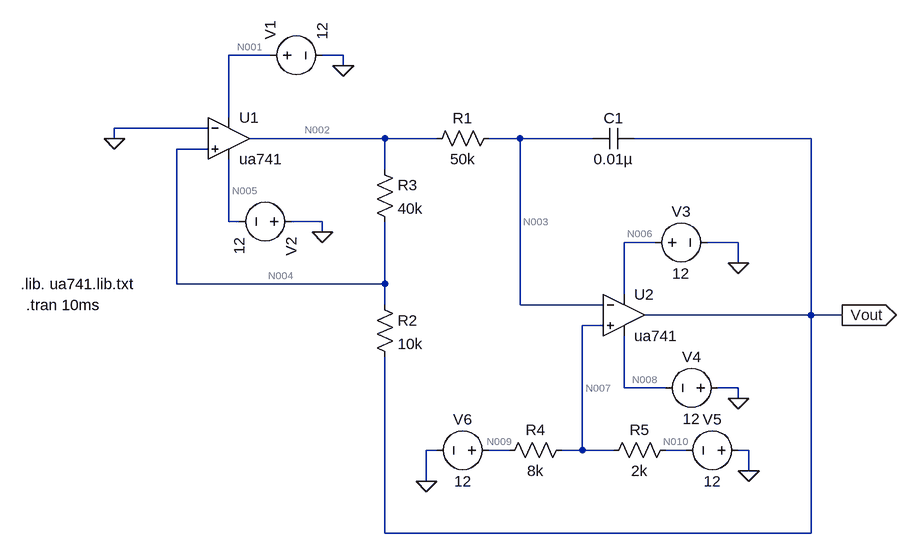
[diagram p0: schematic Sawtooth.asc]
Sawtooth.asc, the LTspice schematic file:
Version 4
SHEET 1 1280 772
WIRE 288 32 224 32
WIRE 400 32 368 32
WIRE 400 48 400 32
WIRE 224 128 224 32
WIRE 192 144 48 144
WIRE 48 160 48 144
WIRE 464 160 256 160
WIRE 544 160 464 160
WIRE 672 160 624 160
WIRE 784 160 672 160
WIRE 1120 160 848 160
WIRE 192 176 144 176
WIRE 464 208 464 160
WIRE 224 288 224 192
WIRE 240 288 224 288
WIRE 368 288 320 288
WIRE 368 304 368 288
WIRE 880 320 832 320
WIRE 1008 320 960 320
WIRE 1008 352 1008 320
WIRE 144 384 144 176
WIRE 464 384 464 288
WIRE 464 384 144 384
WIRE 832 400 832 320
WIRE 464 416 464 384
WIRE 672 416 672 160
WIRE 800 416 672 416
WIRE 1120 432 1120 160
WIRE 1120 432 864 432
WIRE 1168 432 1120 432
WIRE 800 448 768 448
WIRE 832 544 832 464
WIRE 896 544 832 544
WIRE 1008 544 976 544
WIRE 1008 560 1008 544
WIRE 544 640 528 640
WIRE 656 640 624 640
WIRE 768 640 768 448
WIRE 768 640 736 640
WIRE 816 640 768 640
WIRE 928 640 896 640
WIRE 1024 640 1008 640
WIRE 1024 672 1024 640
WIRE 528 688 528 640
WIRE 464 768 464 496
WIRE 1120 768 1120 432
WIRE 1120 768 464 768
FLAG 400 48 0
FLAG 368 304 0
FLAG 48 160 0
FLAG 1008 352 0
FLAG 1008 560 0
FLAG 1168 432 Vout
IOPIN 1168 432 Out
FLAG 528 688 0
FLAG 1024 672 0
SYMBOL voltage 272 32 R270
WINDOW 123 0 0 Left 0
WINDOW 39 0 0 Left 0
SYMATTR InstName V1
SYMATTR Value 12
SYMBOL voltage 336 288 R90
WINDOW 123 0 0 Left 0
WINDOW 39 0 0 Left 0
SYMATTR InstName V2
SYMATTR Value 12
SYMBOL res 640 144 R90
WINDOW 0 0 56 VBottom 2
WINDOW 3 32 56 VTop 2
SYMATTR InstName R1
SYMATTR Value 50k
SYMBOL res 448 400 R0
SYMATTR InstName R2
SYMATTR Value 10k
SYMBOL res 448 192 R0
SYMATTR InstName R3
SYMATTR Value 40k
SYMBOL cap 848 144 R90
WINDOW 0 0 32 VBottom 2
WINDOW 3 32 32 VTop 2
SYMATTR InstName C1
SYMATTR Value 0.01µ
SYMBOL OpAmps\\ua741 224 96 R0
SYMATTR InstName U1
SYMBOL OpAmps\\ua741 832 368 R0
SYMATTR InstName U2
SYMBOL voltage 864 320 R270
WINDOW 0 32 56 VTop 2
WINDOW 3 -32 56 VBottom 2
SYMATTR InstName V3
SYMATTR Value 12
SYMBOL voltage 992 544 R90
WINDOW 0 -32 56 VBottom 2
WINDOW 3 32 56 VTop 2
SYMATTR InstName V4
SYMATTR Value 12
SYMBOL res 752 624 R90
WINDOW 0 0 56 VBottom 2
WINDOW 3 32 56 VTop 2
SYMATTR InstName R4
SYMATTR Value 8k
SYMBOL res 912 624 R90
WINDOW 0 0 56 VBottom 2
WINDOW 3 32 56 VTop 2
SYMATTR InstName R5
SYMATTR Value 2k
SYMBOL voltage 1024 640 R90
WINDOW 0 -32 56 VBottom 2
WINDOW 3 32 56 VTop 2
SYMATTR InstName V5
SYMATTR Value 12
SYMBOL voltage 640 640 R90
WINDOW 0 -32 56 VBottom 2
WINDOW 3 32 56 VTop 2
SYMATTR InstName V6
SYMATTR Value 12
TEXT -88 416 Left 2 !.tran 10ms
TEXT -96 384 Left 2 !.lib. ua741.lib.txt

The netlist it stands for:
* Sawtooth.asc
V1 N001 0 12
V2 0 N005 12
R1 N003 N002 50k
R2 N004 Vout 10k
R3 N002 N004 40k
C1 Vout N003 0.01µ
XU1 N004 0 N001 N005 N002 ua741  ; pins In+ In- V+ V- OUT
XU2 N007 N003 N006 N008 Vout ua741  ; pins In+ In- V+ V- OUT
V3 N006 0 12
V4 0 N008 12
R4 N007 N009 8k
R5 N010 N007 2k
V5 0 N010 12
V6 N009 0 12
.tran 10ms
.lib. ua741.lib.txt
.backanno
.end

* Results of the author's LTspice run, read from the files saved beside the schematic
* Operating Point, zero values left out:
*   V(n001) = 12 V
*   V(n005) = -12 V
*   V(n003) = -7.2 V
*   V(n002) = -7.196 V
*   V(n004) = -55.51 µV
*   V(vout) = 1.8 V
*   V(n008) = -12 V
*   V(n006) = 12 V
*   V(n007) = -7.2 V
*   V(n009) = 12 V
*   V(n010) = -12 V
*   I(R5) = -2.4 mA
*   I(R4) = -2.4 mA
*   I(R3) = -179.9 µA
*   I(R2) = -180 µA
*   I(R1) = -77.1 nA
*   I(V6) = -2.4 mA
*   I(V5) = -2.4 mA
*   I(V4) = -1.337 mA
*   I(V3) = -1.336 mA
*   I(V2) = -1.337 mA
*   I(V1) = -1.337 mA
*   Ix(u1:1) = 79.69 nA
*   Ix(u1:2) = 79.8 nA
*   Ix(u1:3) = 1.337 mA
*   Ix(u1:4) = -1.337 mA
*   Ix(u1:5) = 179.8 µA
*   Ix(u2:1) = 76.62 nA
*   Ix(u2:2) = 77.1 nA
*   Ix(u2:3) = 1.336 mA
*   Ix(u2:4) = -1.337 mA
*   Ix(u2:5) = -180 µA
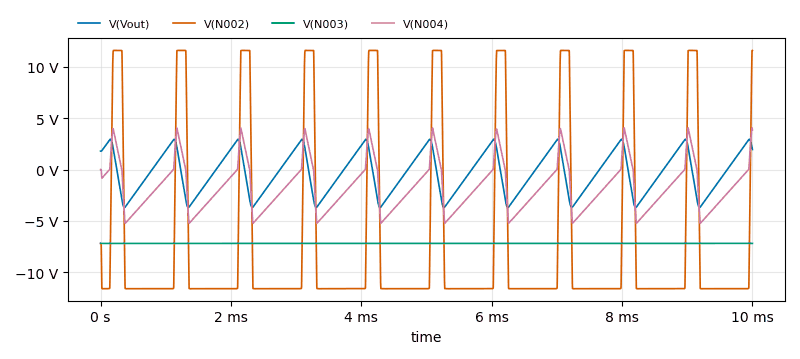
[diagram p1: Transient Analysis of Sawtooth.asc, plotted from the saved traces]
* Transient Analysis, 1 run:
*   V(Vout): min -3.696 V, max 2.959 V, average -319.4 mV, rms 2.852 V, last 1.953 V
*   V(N002): min -11.62 V, max 11.62 V, average -7.206 V, rms 11.23 V, last 11.61 V
*   V(N003): min -7.201 V, max -7.194 V, average -7.2 V, rms 7.2 V, last -7.194 V
*   V(N004): min -5.242 V, max 4.066 V, average -1.697 V, rms 3.314 V, last 3.884 V